# Altium schematic sheet stm32f103.SchDoc
size A4
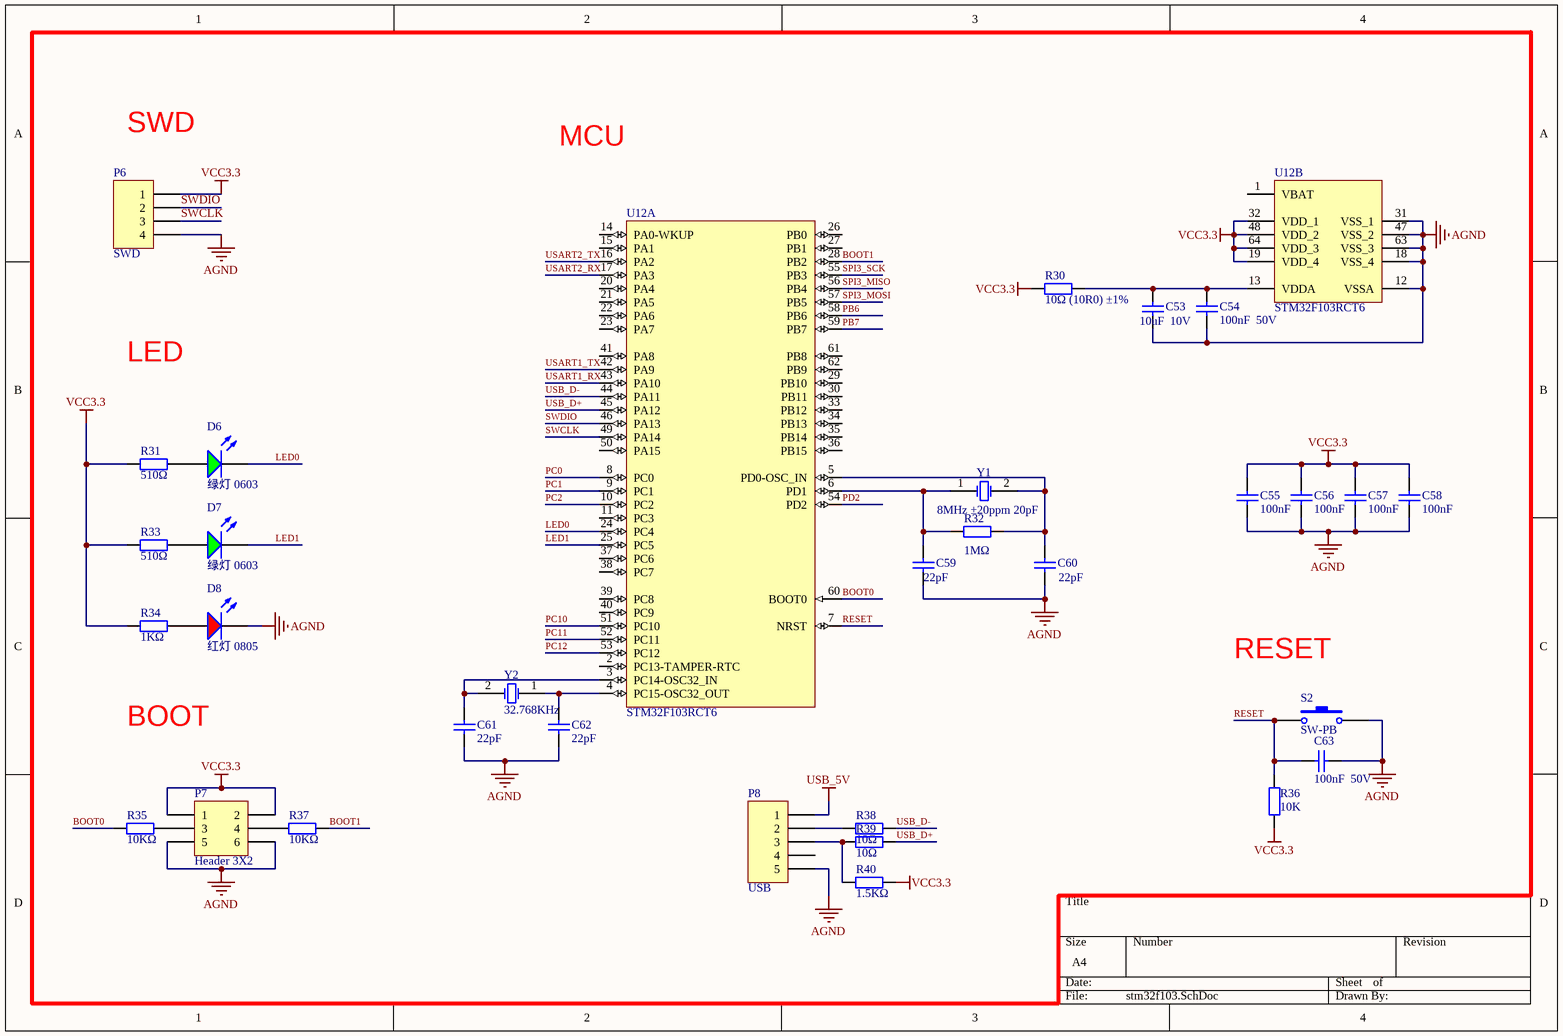
[diagram p0: stm32f103.SchDoc]

## Parts
C53  10uF  10V  [0603_C]
C54  100nF  50V  [0603_C]
C55  100nF  [0603_C]
C56  100nF  [0603_C]
C57  100nF  [0603_C]
C58  100nF  [0603_C]
C59  22pF  [0603_C]
C60  22pF  [0603_C]
C61  22pF  [0603_C]
C62  22pF  [0603_C]
C63  100nF  50V  [0603_C]
D6  绿灯 0603  [0603_LED_S1]
D7  绿灯 0603  [0603_LED_S1]
D8  红灯 0805  [0805_LED_S1]
P6  SWD  [HDR1X4]
P7  Header 3X2  [HDR2X3]
P8  USB  [MICRO-USB]
R30  10Ω (10R0) ±1%  [0603_R]
R31  510Ω  [0603_R]
R32  1MΩ  [0603_R]
R33  510Ω  [0603_R]
R34  1KΩ  [0603_R]
R35  10KΩ  [0603_R]
R36  10K  [0603_R]
R37  10KΩ  [0603_R]
R38  10Ω  [0603_R]
R39  10Ω  [0603_R]
R40  1.5KΩ  [0603_R]
S2  SW-PB  [key_4.5*4.5*3.8]
U12  STM32F103RCT6  [LQFP-64_10x10x05P]  (parts A,B of 2)
Y1  8MHz ±20ppm 20pF  [SMD-5032_2P]
Y2  32.768KHz  [SMD-3215_2P FC - 135]

## Nets
AGND: C53.1 C54.1 C55.1 C56.1 C57.1 C58.1 C59.1 C60.1 C61.1 C62.1 C63.1 D8.K P6.4 P7.5 P7.6 P8.5 S2.2 U12.12(VSSA) U12.18(VSS_4) U12.31(VSS_1) U12.47(VSS_2) U12.63(VSS_3)
USB_5V: P8.1
VCC3.3: C55.2 C56.2 C57.2 C58.2 P6.1 P7.1 P7.2 R30.1 R31.1 R33.1 R34.1 R36.1 R40.2 U12.19(VDD_4) U12.32(VDD_1) U12.48(VDD_2) U12.64(VDD_3)
BOOT0: R35.1 U12.60(BOOT0)
BOOT1: R37.2 U12.28(PB2)
LED0: D6.K U12.24(PC4)
LED1: D7.K U12.25(PC5)
PB6: U12.58(PB6)
PB7: U12.59(PB7)
PC0: U12.8(PC0)
PC1: U12.9(PC1)
PC2: U12.10(PC2)
PC10: U12.51(PC10)
PC11: U12.52(PC11)
PC12: U12.53(PC12)
PD2: U12.54(PD2)
RESET: C63.2 R36.2 S2.1 U12.7(NRST)
SPI3_MISO: U12.56(PB4)
SPI3_MOSI: U12.57(PB5)
SPI3_SCK: U12.55(PB3)
SWCLK: P6.3 U12.49(PA14)
SWDIO: P6.2 U12.46(PA13)
USART1_RX: U12.43(PA10)
USART1_TX: U12.42(PA9)
USART2_RX: U12.17(PA3)
USART2_TX: U12.16(PA2)
USB_D+: R39.2 U12.45(PA12)
USB_D-: R38.2 U12.44(PA11)
NetC53_2: C53.2 C54.2 R30.2 U12.13(VDDA)
NetC59_2: C59.2 R32.1 U12.6(PD1) Y1.1(OSC1)
NetC60_2: C60.2 R32.2 U12.5(PD0-OSC_IN) Y1.2(OSC2)
NetC61_2: C61.2 U12.3(PC14-OSC32_IN) Y2.2(OSC2)
NetC62_2: C62.2 U12.4(PC15-OSC32_OUT) Y2.1(OSC1)
NetD6_A: D6.A R31.2
NetD7_A: D7.A R33.2
NetD8_A: D8.A R34.2
NetP7_3: P7.3 R35.2
NetP7_4: P7.4 R37.1
NetP8_2: P8.2 R38.1
NetP8_3: P8.3 R39.1 R40.1

Not connected (* = marked no-connect by the designer): P8 4; U12 1(VBAT) 2(PC13-TAMPER-RTC) 11(PC3) 14(PA0-WKUP) 15(PA1) 20(PA4) 21(PA5) 22(PA6) 23(PA7) 26(PB0) 27(PB1) 29(PB10) 30(PB11) 33(PB12) 34(PB13) 35(PB14) 36(PB15) 37(PC6) 38(PC7) 39(PC8) 40(PC9) 41(PA8) 50(PA15) 61(PB8) 62(PB9)

## Notes on the sheet
- SWD
- MCU
- LED
- RESET
- BOOT

## Library data of the parts
C53 = 0603 10uF (106) 10% 10V: 贴片电容; ComponentLink1Description: 供应商链接; ComponentLink1URL: http://www.szlcsc.com/product/details_20411.html; Package: 0603; Supplier: LC; SuppliersPartNumber: C19702
C54-C58 C63 = 0603 100nF (104) 10% 50V: 贴片电容; ComponentLink1Description: 供应商链接; ComponentLink1URL: http://www.szlcsc.com/product/details_15331.html; Package: 0603; Supplier: LC; SuppliersPartNumber: C14663
C59 C60 = 0603 22pF (220) 5% 50V: 贴片电容; ComponentLink1Description: 供应商链接; ComponentLink1URL: http://www.szlcsc.com/product/details_2005.html; Package: 0603; Supplier: LC; SuppliersPartNumber: C1653
C61 C62 = 0603 10pF (100) 5% 50V: 贴片电容; ComponentLink1Description: 供应商链接; ComponentLink1URL: http://www.szlcsc.com/product/details_1986.html; Package: 0603; Supplier: LC; SuppliersPartNumber: C1634
D6 D7 = 0603 绿灯: 发光二极管; ComponentLink1Description: 供应商链接; ComponentLink1URL: http://www.szlcsc.com/product/details_73152.html; Package: 0603; Supplier: LC; SuppliersPartNumber: C72043
D8 = 0805 红灯: 发光二极管; ComponentLink1Description: 供应商链接; ComponentLink1URL: http://www.szlcsc.com/product/details_2668.html; Package: 0805; Supplier: LC; SuppliersPartNumber: C2295
P6 = Header 4: Header, 4-Pin; LatestRevisionDate: 17-Jul-2002; LatestRevisionNote: Re-released for DXP Platform.; Publisher: Altium Limited
P7 = Header 3X2: Header, 3-Pin, Dual row; LatestRevisionDate: 17-Jul-2002; LatestRevisionNote: Re-released for DXP Platform.; Publisher: Altium Limited
P8 = Header 5: Header, 5-Pin; LatestRevisionDate: 17-Jul-2002; LatestRevisionNote: Re-released for DXP Platform.; Publisher: Altium Limited
R30 R36 R38 R39 = 0603 10Ω (10R0) 1%: 贴片电阻; ComponentLink1Description: 供应商链接; ComponentLink1URL: http://www.szlcsc.com/product/details_23586.html; Package: 0603; Supplier: LC; SuppliersPartNumber: C22859
R31 R33 = 0603 510Ω (5100) 1%: 贴片电阻; ComponentLink1Description: 供应商链接; ComponentLink1URL: http://www.szlcsc.com/product/details_23920.html; Package: 0603; Supplier: LC; SuppliersPartNumber: C23193
R32 = 0603 1.2MΩ (1204) 1%: 贴片电阻; ComponentLink1Description: 供应商链接; ComponentLink1URL: http://www.szlcsc.com/product/details_23493.html; Package: 0603; Supplier: LC; SuppliersPartNumber: C22766
R34 = 0603 1KΩ (1001) 1%: 贴片电阻; ComponentLink1Description: 供应商链接; ComponentLink1URL: http://www.szlcsc.com/product/details_21904.html; Package: 0603; Supplier: LC; SuppliersPartNumber: C21190
R35 R37 = 0603 10KΩ (1002) 1%: 贴片电阻; ComponentLink1Description: 供应商链接; ComponentLink1URL: http://www.szlcsc.com/product/details_26547.html; Package: 0603; Supplier: LC; SuppliersPartNumber: C25804
R40 = 0603 1.5KΩ (1501) 1%: 贴片电阻; ComponentLink1Description: 供应商链接; ComponentLink1URL: http://www.szlcsc.com/product/details_23570.html; Package: 0603; Supplier: LC; SuppliersPartNumber: C22843
S2 = SW-PB: Switch; Published: 24-Mar-1999; LatestRevisionDate: 17-Jul-2002; LatestRevisionNote: Re-released for DXP Platform.; PackageReference: SPST-2; Publisher: Altium Limited; PackageDescription: Switch; 2 Leads
U12 = STM32F103RCT6: ARM; ComponentLink1Description: 供应商链接; ComponentLink1URL: http://www.szlcsc.com/product/details_8815.html; Package: LQFP-64_10x10x05P; Supplier: LC; SuppliersPartNumber: C8323
Y1 Y2 = SMD-5032_2P 8MHz 20ppm 20pF: 贴片晶振; ComponentLink1Description: 供应商链接; ComponentLink1URL: http://www.szlcsc.com/product/details_117214.html; Package: SMD-5032_2P; Supplier: LC; SuppliersPartNumber: C115962